# EAGLE schematic Blinky_board (EAGLE 7.5.0)
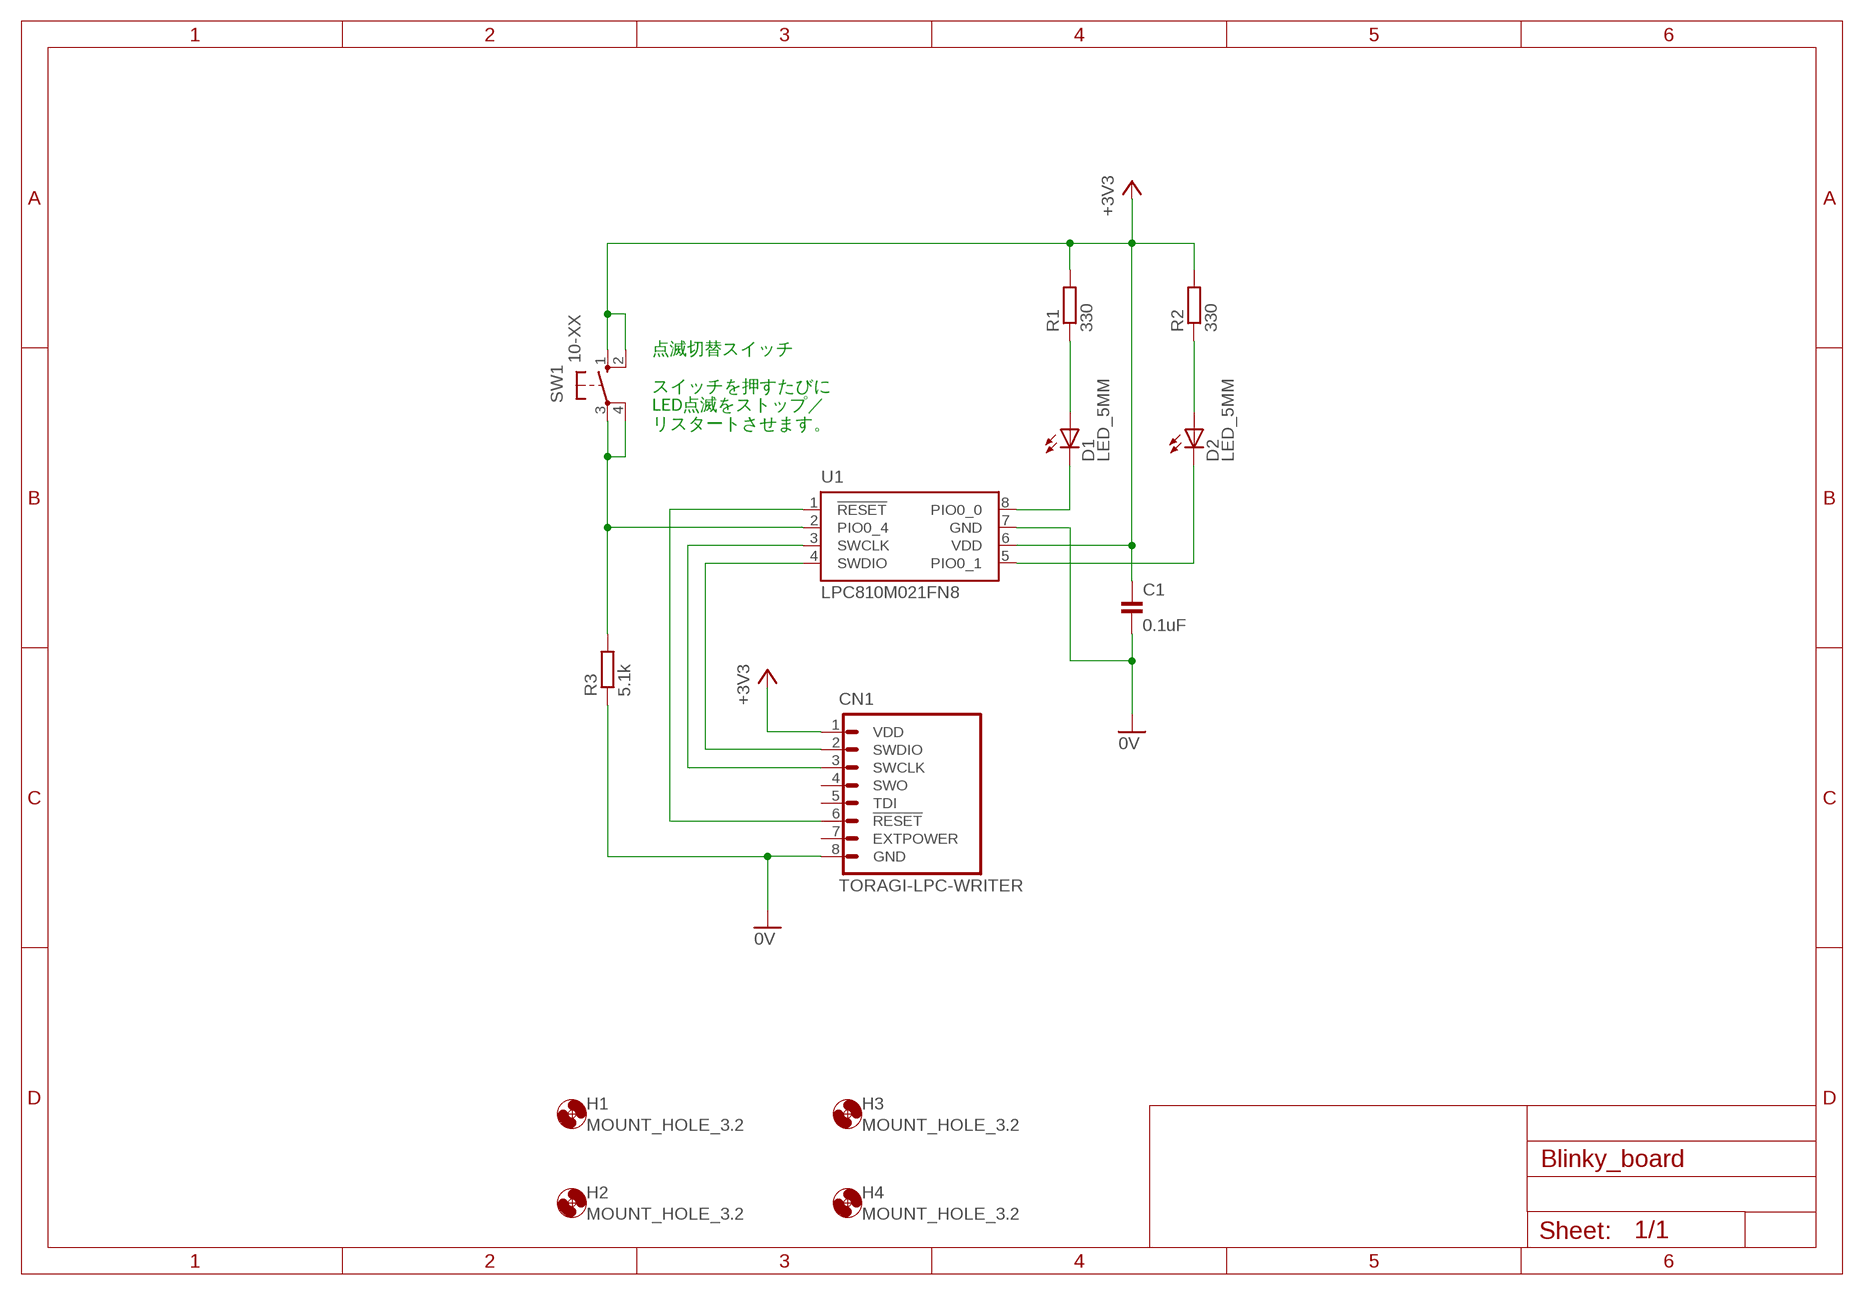
[diagram p0: schematic, sheet 1]

## Parts
C1  0.1uF  CAP_100MIL  [CAP_100MIL]
CN1  TORAGI-LPC-WRITER  [TORAGI-LPC-WRITER]
D1  LED_5MM  [LED5MM]
D2  LED_5MM  [LED5MM]
H1  MOUNT_HOLE_3.2  [3,2]
H2  MOUNT_HOLE_3.2  [3,2]
H3  MOUNT_HOLE_3.2  [3,2]
H4  MOUNT_HOLE_3.2  [3,2]
R1  330  RESISTOR_200MIL  [RESISTOR_0204_200MIL]
R2  330  RESISTOR_200MIL  [RESISTOR_0204_200MIL]
R3  5.1k  RESISTOR_200MIL  [RESISTOR_0204_200MIL]
SW1  10-XX  [B3F-10XX]
U1  LPC810M021FN8  [DIL08]

## Nets
0V: C1.2 CN1.8(GND) R3.1 U1.7(GND)
+3V3: C1.1 CN1.1(VDD) R1.2 R2.2 SW1.1(S) SW1.2(S1) U1.6(VDD)
N$1: D1.A R1.1
N$2: D2.A R2.1
N$3: CN1.6(!RESET!) U1.1(!RESET!)
N$4: CN1.2(SWDIO) U1.4(SWDIO)
N$5: D2.K(C) U1.5(PIO0_1)
N$6: D1.K(C) U1.8(PIO0_0)
N$7: CN1.3(SWCLK) U1.3(SWCLK)
N$10: R3.2 SW1.3(P) SW1.4(P1) U1.2(PIO0_4)
Unconnected: CN1.4(SWO) CN1.5(TDI) CN1.7(EXTPOWER)

## Notes on the sheet
- 点滅切替スイッチ
  
  スイッチを押すたびに
  LED点滅をストップ／
  リスタートさせます。

## Library data of the parts
C1 = Parts:CAP: コンデンサー
CN1 = PartsForProto:TORAGI-LPC-WRITER: Toragi-LPC Writer CMSIS-DAP トラ技ARMライタ（CN5）
D1 D2 = Parts:LED: 発光ダイオード
H1-H4 = Generic:MOUNT_HOLE
R1-R3 = Parts:RESISTOR: 抵抗器
SW1 = Parts:10-XX: TACT SWITCH
U1 = Parts:LPC810: ＡＲＭ Ｃｏｒｔｅｘ－Ｍ０搭載 低消費・高性能３２ｂｉｔマイコン ・３０ＭＨｚクロックスピード（最大） ・Ｆｌａｓｈ：４ＫＢ ・ＲＡＭ：１ＫＢ ・ＲＣオシレータ：１２ＭＨｚ、１％精度 ・ＵＡＲＴ（ＲＳ－４８５） ・ＳＳＰ／ＳＰＩ ・Ｉ２Ｃ（Ｆｍ＋） ・各種タイマー ・ＧＰＩＯ：６本